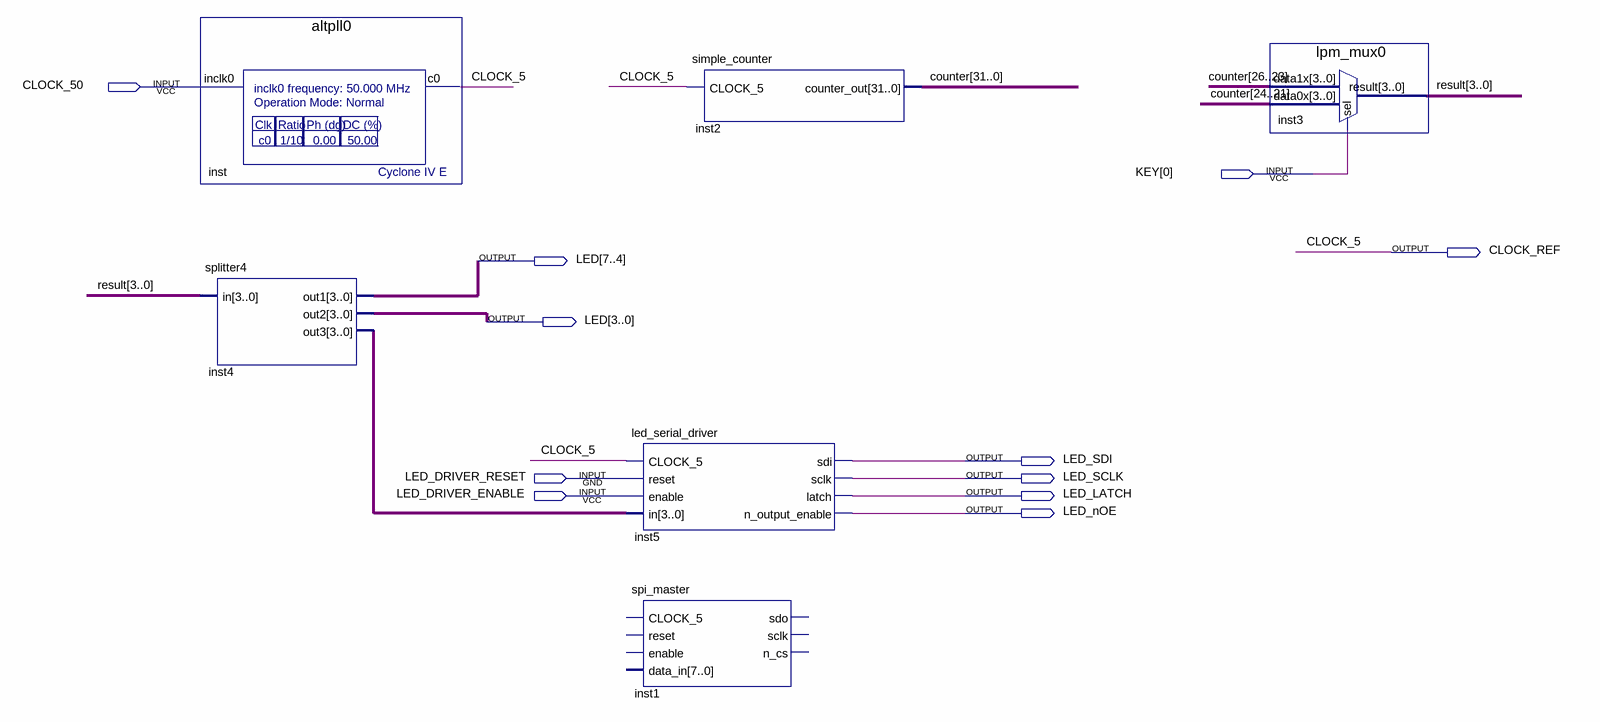
[diagram p0: schematic sheet]
// Quartus schematic test.bdf as structural Verilog: 6 symbols, 11 pins
module test (
  input  CLOCK_50,
  input  [0:0] KEY,
  input  LED_DRIVER_RESET,
  input  LED_DRIVER_ENABLE,
  output CLOCK_REF,
  output [7:0] LED,
  output LED_SDI,
  output LED_SCLK,
  output LED_LATCH,
  output LED_nOE
);

  wire [3:0] inst4_out3, result;
  wire [31:0] counter;

  altpll0 inst (.inclk0(CLOCK_50), .c0(CLOCK_REF));
  splitter4 inst4 (.in(result), .out1(LED[7:4]), .out2(LED[3:0]), .out3(inst4_out3));
  led_serial_driver inst5 (
    .CLOCK_5(CLOCK_REF), .reset(LED_DRIVER_RESET), .enable(LED_DRIVER_ENABLE), .in(inst4_out3),
    .sdi(LED_SDI), .sclk(LED_SCLK), .latch(LED_LATCH), .n_output_enable(LED_nOE));
  spi_master inst1 ();  // open: CLOCK_5, reset, enable, data_in, sdo, sclk, n_cs
  simple_counter inst2 (.CLOCK_5(CLOCK_REF), .counter_out(counter));
  lpm_mux0 inst3 (.data1x(counter[26:23]), .data0x(counter[24:21]), .sel(KEY[0]), .result(result));

  // Other names for the same wires on the sheet: CLOCK_5 = CLOCK_REF
endmodule
